# Altium project 0.96_OLED_screen.PrjPcb
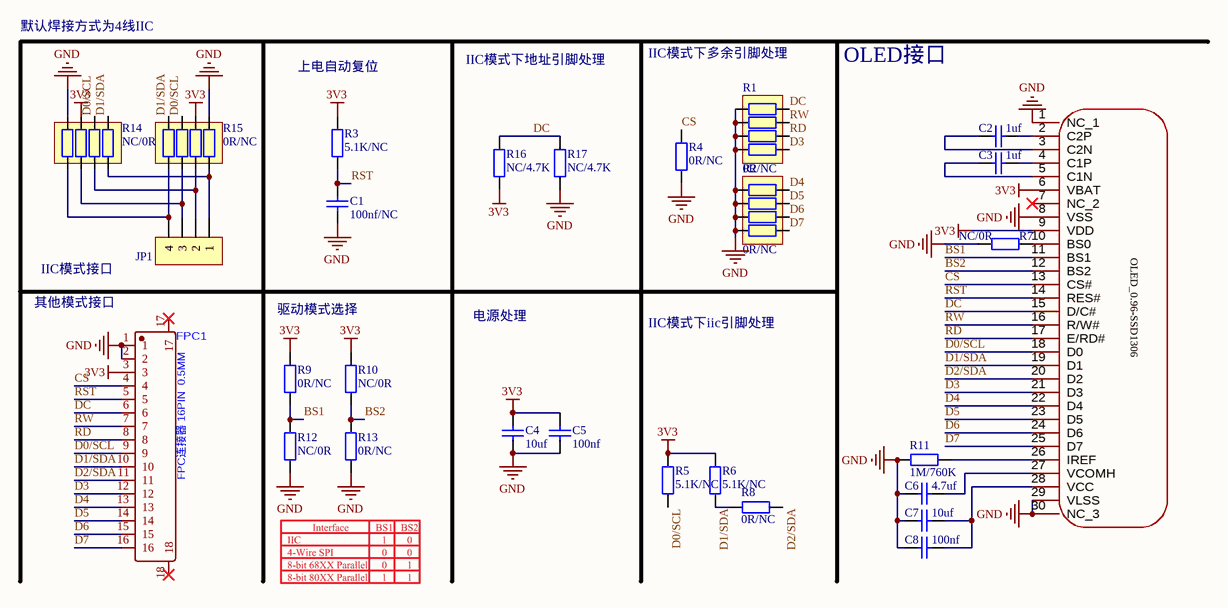
[diagram p0: Sheet1.SchDoc]
1 sheet, 28 parts. Net scope: global (net labels, ports and power ports of the same name join across sheets).
Board file: PCB1.PcbDoc

## Sheet Sheet1.SchDoc
size A4; SheetNumber: 1; SheetTotal: 1

### Parts
C1  100nf/NC  [C0402_L]
C2  1uf  [C0402_L]
C3  1uf  [C0402_L]
C4  10uf  [C0402_L]
C5  100nf  [C0402_L]
C6  4.7uf  [C0402_L]
C7  10uf  [C0402_L]
C8  100nf  [C0402_L]
FPC1  FPC连接器 16PIN  0.5MM  [FPC-SMD_FPC-0.5MM-16P]
JP1  HDR-1X4  [HDR2.54-LI-4P]  (value not drawn)
R1  0R/NC  [RCA-8P4R-0402]
R2  0R/NC  [RCA-8P4R-0402]
R3  5.1K/NC  [R0402_L]
R4  0R/NC  [R0402_L]
R5  5.1K/NC  [R0402_L]
R6  5.1K/NC  [R0402_L]
R7  NC/0R  [R0402_L]
R8  0R/NC  [R0402_L]
R9  0R/NC  [R0402_L]
R10  NC/0R  [R0402_L]
R11  1M/760K  [R0402_L]
R12  NC/0R  [R0402_L]
R13  0R/NC  [R0402_L]
R14  NC/0R  [RCA-8P4R-0402]
R15  0R/NC  [RCA-8P4R-0402]
R16  NC/4.7K  [R0402_L]
R17  NC/4.7K  [R0402_L]
U1  SSD1306  [1.3OLED-2]  (value not drawn)

### Nets
3V3: C4.2 C5.2 FPC1.3 R3.1 R5.2 R6.2 R9.2 R10.2 R14.7 R15.6 R16.2 U1.6(VBAT) U1.9(VDD)
GND: C1.1 C4.1 C5.1 C6.1 C7.1 C8.1 FPC1.1 FPC1.2 R1.1 R1.2 R1.3 R1.4 R2.1 R2.2 R2.3 R2.4 R4.2 R7.2 R11.1 R12.1 R13.1 R14.8 R15.5 R17.2 U1.1(NC_1) U1.8(VSS) U1.29(VLSS) U1.30(NC_3)
BS1: R9.1 R12.2 U1.11(BS1)
BS2: R10.1 R13.2 U1.12(BS2)
CS: FPC1.4 R4.1 U1.13(CS#)
D0/SCL: FPC1.9 R5.1 R14.6 R15.7 U1.18(D0)
D1/SDA: FPC1.10 R6.1 R8.2 R14.5 R15.8 U1.19(D1)
D2/SDA: FPC1.11 R8.1 U1.20(D2)
D3: FPC1.12 R1.5 U1.21(D3)
D4: FPC1.13 R2.8 U1.22(D4)
D5: FPC1.14 R2.7 U1.23(D5)
D6: FPC1.15 R2.6 U1.24(D6)
D7: FPC1.16 R2.5 U1.25(D7)
DC: FPC1.6 R1.8 R16.1 R17.1 U1.15(D/C#)
RD: FPC1.8 R1.6 U1.17(E/RD#)
RST: C1.2 FPC1.5 R3.2 U1.14(RES#)
RW: FPC1.7 R1.7 U1.16(R/W#)
NetC2_1: C2.1 U1.3(C2N)
NetC2_2: C2.2 U1.2(C2P)
NetC3_1: C3.1 U1.5(C1N)
NetC3_2: C3.2 U1.4(C1P)
NetC6_2: C6.2 U1.27(VCOMH)
NetC7_2: C7.2 C8.2 U1.28(VCC)
NetJP1_1: JP1.1 R14.4 R15.4
NetJP1_2: JP1.2 R14.3 R15.3
NetJP1_3: JP1.3 R14.2 R15.2
NetJP1_4: JP1.4 R14.1 R15.1
NetR7_1: R7.1 U1.10(BS0)
NetR11_2: R11.2 U1.26(IREF)

Not connected (* = marked no-connect by the designer): FPC1 17* 18*; U1 7(NC_2)*

### Notes on the sheet
- 默认焊接方式为4线IIC
- 上电自动复位
- IIC模式下地址引脚处理
- IIC模式下多余引脚处理
- OLED接口
- IIC模式接口
- 其他模式接口
- 驱动模式选择
- 电源处理
- IIC模式下iic引脚处理
- (in symbol SSD1306) OLED_0.96-SSD1306

### Library data of the parts
C1-C8 = C: 贴片电容/MLCC电容
JP1 = Header 4: 4P接插件
R1 R2 R15 = R-8P4R: 贴片4P排阻
R3-R14 R16 R17 = R: 贴片电阻